# EAGLE design soundboard-qtpy-usd-dac-smaller-v02 (EAGLE 7.7.0)
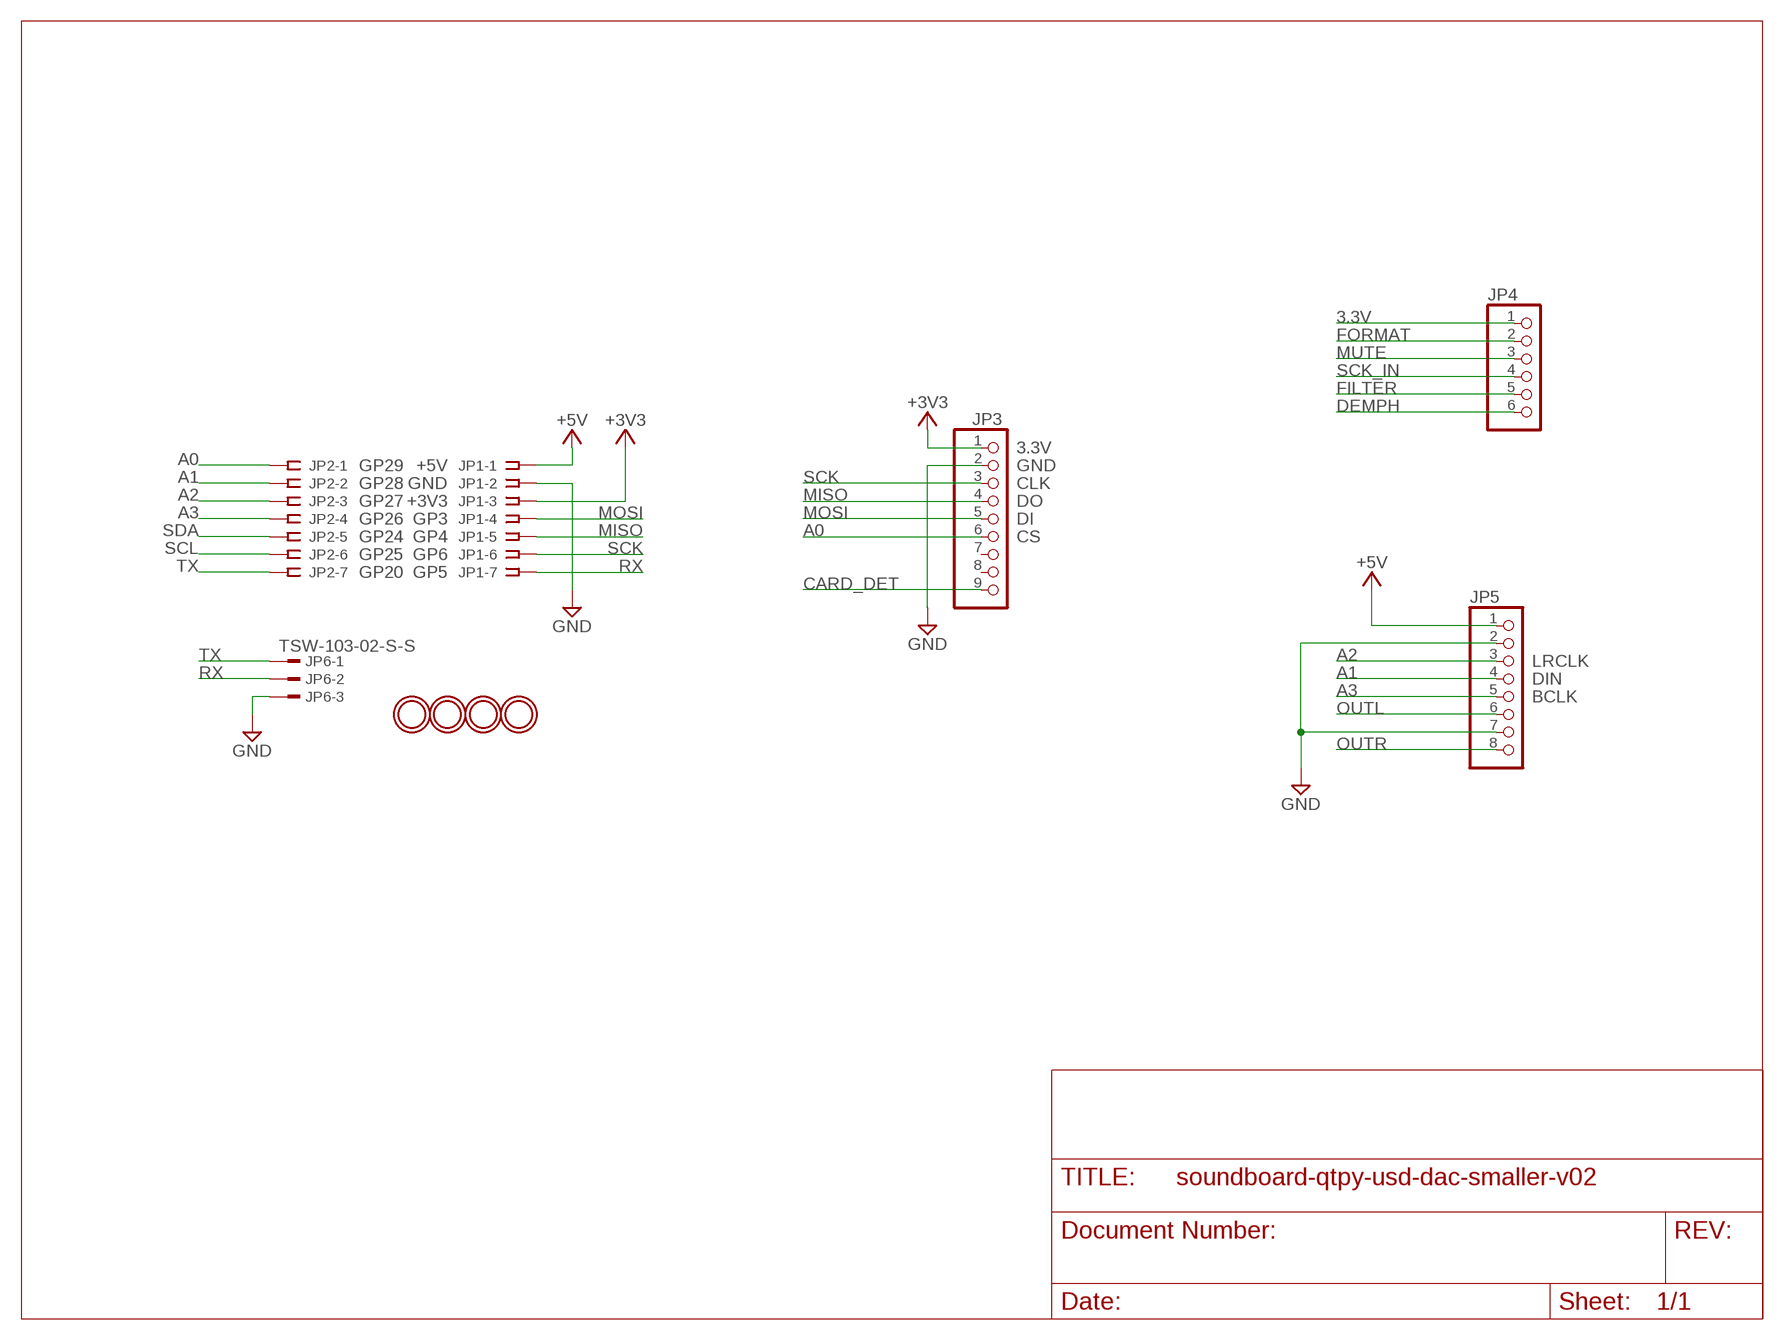
[diagram p0: schematic, sheet 1]

## Parts
JP1  SSW-107-02-S-S  [SSW-107-02-S-S]
JP2  SSW-107-02-S-S  [SSW-107-02-S-S]
JP3  HEADER-1X970MIL  [1X09_ROUND_70]
JP4  HEADER-1X670MIL  [1X06_ROUND_70]
JP5  HEADER-1X8ROUND  [1X08_ROUND]
JP6  TSW-103-02-S-S  [TSW-103-02-S-S]
U$11  MOUNTINGHOLE2.5  [MOUNTINGHOLE_2.5_PLATED]
U$12  MOUNTINGHOLE2.5  [MOUNTINGHOLE_2.5_PLATED]
U$13  MOUNTINGHOLE2.5  [MOUNTINGHOLE_2.5_PLATED]
U$14  MOUNTINGHOLE2.5  [MOUNTINGHOLE_2.5_PLATED]

## Nets
3.3V: JP4.1
+3V3: JP1.3 JP3.1
+5V: JP1.1 JP5.1
A0: JP2.1 JP3.6
A1: JP2.2 JP5.4
A2: JP2.3 JP5.3
A3: JP2.4 JP5.5
CARD_DET: JP3.9
DEMPH: JP4.6
FILTER: JP4.5
FORMAT: JP4.2
GND: JP1.2 JP3.2 JP5.2 JP5.7 JP6.3
MISO: JP1.5 JP3.4
MOSI: JP1.4 JP3.5
MUTE: JP4.3
OUTL: JP5.6
OUTR: JP5.8
RX: JP1.7 JP6.2
SCK: JP1.6 JP3.3
SCK_IN: JP4.4
SCL: JP2.6
SDA: JP2.5
TX: JP2.7 JP6.1
Unconnected: JP3.7 JP3.8

## Notes on the sheet
- 3.3V
- GP29 | +5V | GND
- GP28 | GND | CLK
- GP27 | +3V3 | DO
- GP26 | GP3 | DI
- GP24 | GP4 | CS
- GP25 | GP6
- GP20 | GP5
- LRCLK
- DIN
- BCLK

## Library data of the parts
JP1 JP2 = con-samtec:SSW-107-02-S-S: THROUGH-HOLE .025" SQ POST SOCKET Source: Samtec SSW.pdf; MPN: SSW-107-02-S-S; OC_FARNELL: unknown; OC_NEWARK: 11P9433
JP3 = microbuilder:HEADER-1X9: PIN HEADER
JP4 = microbuilder:HEADER-1X6: PIN HEADER
JP5 = microbuilder:HEADER-1X8: PIN HEADER
JP6 = con-samtec:TSW-103-02-S-S: THROUGH-HOLE .025" SQ POST HEADER Source: Samtec TSW.pdf; OC_FARNELL: unknown; OC_NEWARK: unknown
U$11-U$14 = adafruit_electromech:MOUNTINGHOLE: Mounting Hole For #2 screws (0.086"/2.18mm width, 0.094"/2.4mm hole) use 2.5mm; BOM: EXCLUDE

## Board
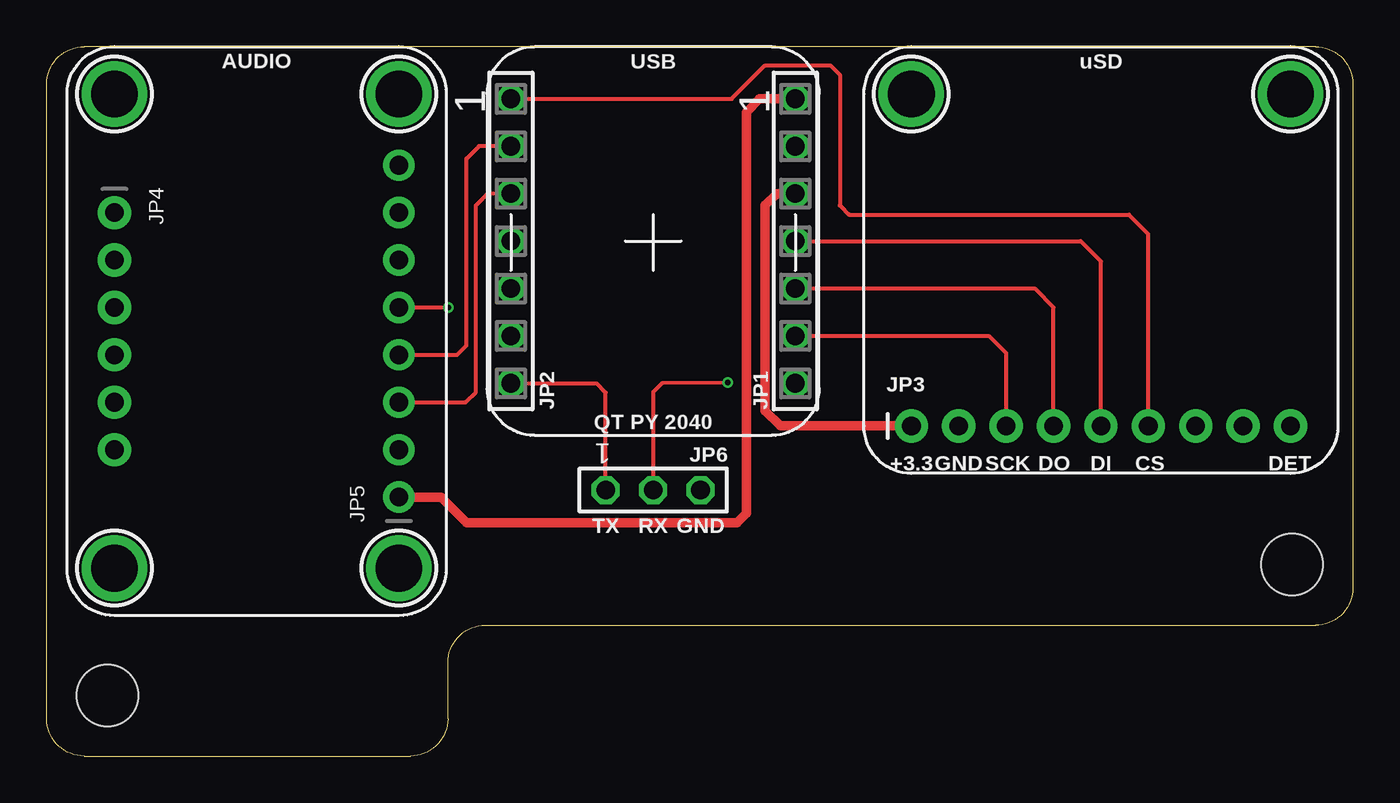
[diagram p1: board, top side]
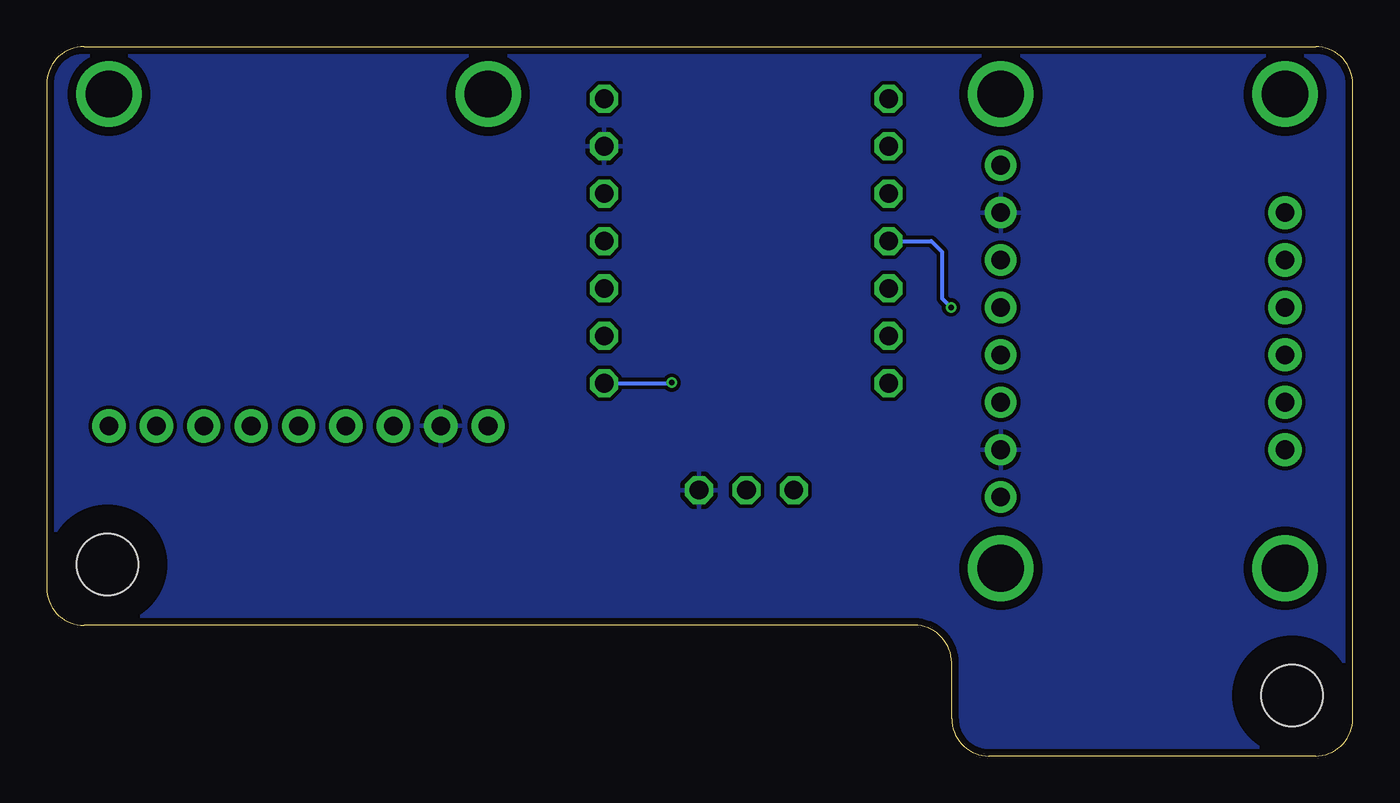
[diagram p2: board, bottom side, seen from below]

Size 70 x 38 mm. Coordinates in mm from the lower left corner, seen from the top.
Outline: 2,0 19.5,0 arc90 21.5,2 21.5,5 arc-90 23.5,7 68,7 arc90 70,9 70,36 arc90 68,38 2,38 arc90 0,36 0,2 arc90 2,0
Copper layers (1*16): Top 0.035559375mm / dielectric 1.6mm / Bottom 0.035559375mm
Design rules "oshpark-2layer-2018": minimum track width 6mil, minimum drill 10mil, track to track 6mil, track to pad 6mil, pad to pad 6mil, via to via 6mil, smd to smd 6mil, copper to edge 15mil, drill to drill 6mil, minimum pad ring 5mil, minimum via ring 5mil, stop-mask expansion 2.5mil, vias tented up to drill 0mil, thermal gap 10mil
Holes 3.3 mm at 3.25,3.25 66.75,10.25
tKeepout: area 0.2,0.2 to 6.2,6.2; area 63.8,7.2 to 69.8,13.2
bRestrict: area 0.2,0.2 to 6.2,6.2; area 63.8,7.2 to 69.8,13.2

### Footprints (pad centres in the part's own frame; a part is rotated, then mirrored left to right if it is on the bottom)
SSW-107-02-S-S = drill 1 pad 1.5 octagon: 1 -7.62,0; 2 -5.08,0; 3 -2.54,0; 4 0,0; 5 2.54,0; 6 5.08,0; 7 7.62,0
1X09_ROUND_70 = drill 1 pad 1.778: 1 -10.16,0; 2 -7.62,0; 3 -5.08,0; 4 -2.54,0; 5 0,0; 6 2.54,0; 7 5.08,0; 8 7.62,0; 9 10.16,0
1X06_ROUND_70 = drill 1 pad 1.778: 1 -6.35,0; 2 -3.81,0; 3 -1.27,0; 4 1.27,0; 5 3.81,0; 6 6.35,0
1X08_ROUND = drill 1 pad 1.676: 1 -8.89,0; 2 -6.35,0; 3 -3.81,0; 4 -1.27,0; 5 1.27,0; 6 3.81,0; 7 6.35,0; 8 8.89,0
TSW-103-02-S-S = drill 1 pad 1.5 octagon: 1 2.54,0; 2 0,0; 3 -2.54,0
MOUNTINGHOLE_2.5_PLATED = drill 2.5 pad 3.2: P$1 0,0

### Placement (x,y rotation side)
JP1  40.12,27.59 270 top
JP2  24.88,27.59 270 top
JP3  56.5,17.68 0 top
JP4  3.63,22.76 270 top
JP5  18.87,22.76 90 top
JP6  32.5,14.25 180 top
PLABEL0  [PLABEL0]  20.27,31.78 90 top
PLABEL1  [PLABEL1]  20.27,26.57 90 top
PLABEL2  [PLABEL2]  17.35,13.87 90 top
PLABEL3  [PLABEL3]  1.98,29.11 90 top
PLABEL4  [PLABEL4]  20.39,16.54 90 top
PLABEL5  [PLABEL5]  17.35,23.9 90 top
PLABEL6  [PLABEL6]  17.22,18.95 90 top
PLABEL7  [PLABEL7]  20.52,21.62 90 top
PLABEL8  [PLABEL8]  1.98,21.3 90 top
PLABEL9  [PLABEL9]  1.98,15.9 90 top
PLABEL10  [PLABEL10]  1.98,26.89 90 top
PLABEL11  [PLABEL11]  1.98,18.51 90 top
PLABEL12  [PLABEL12]  17.28,29.05 90 top
PLABEL13  [PLABEL13]  1.98,24.35 90 top
U$1  MOUNTINGHOLE2.5  [MOUNTINGHOLE_2.5_PLATED]  46.34,35.46 0 top
U$2  MOUNTINGHOLE2.5  [MOUNTINGHOLE_2.5_PLATED]  66.66,35.46 0 top
U$11  3.63,35.46 90 top
U$12  18.87,10.06 90 top
U$13  18.87,35.46 90 top
U$14  3.63,10.06 90 top

### Tracks (layer width: path | path; a pad name or v marks a point on that pad's centre or on a via)
+3V3
  Top 0.508: JP1.3 39.13,30.13 38.5,29.5 38.5,18.5 39.32,17.68 JP3.1
+5V
  Top 0.508: JP1.1 38.21,35.21 37.5,34.5 37.5,13 37,12.5 22.5,12.5 21.13,13.87 JP5.1
A0
  Top 0.203: JP2.1 36.71,35.21 38.5,37 42,37 42.5,36.5 42.5,29.5 43,29 58,29 59.04,27.96 JP3.6
A1
  Top 0.203: JP5.4 21.99,21.49 22.5,22 22.5,32 23.17,32.67 JP2.2
A2
  Top 0.203: JP5.3 22.45,18.95 23,19.5 23,29.5 23.63,30.13 JP2.3
A3  (via drill 0.3)
  Top 0.203: JP5.5 v21.53,24.03
  Bottom 0.203: v21.53,24.03 22,24.5 22,27 22.59,27.59 JP2.4
GND
  pour Bottom (isolate 0.203): 0,0 70,0 70,38 0,38
MISO
  Top 0.203: JP1.5 52.95,25.05 53.96,24.04 JP3.4
MOSI
  Top 0.203: JP1.4 55.41,27.59 56.5,26.5 JP3.5
RX  (via drill 0.3)
  Top 0.203: v36.5,20 32.97,19.97 32.5,19.5 JP6.2
  Bottom 0.203: JP1.7 36.5,19.97 v36.5,20
SCK
  Top 0.203: JP1.6 50.49,22.51 51.42,21.58 JP3.3
TX
  Top 0.203: JP2.7 29.47,19.97 29.96,19.47 JP6.1

### Text on the board
_tsilk: AUDIO | USB | uSD | QT PY 2040 | +3.3 | GND | SCK | DO | DI | CS | DET | TX | RX | GND